# Altium project x-IMU3-CC-Serial-Adapter.PrjPcb
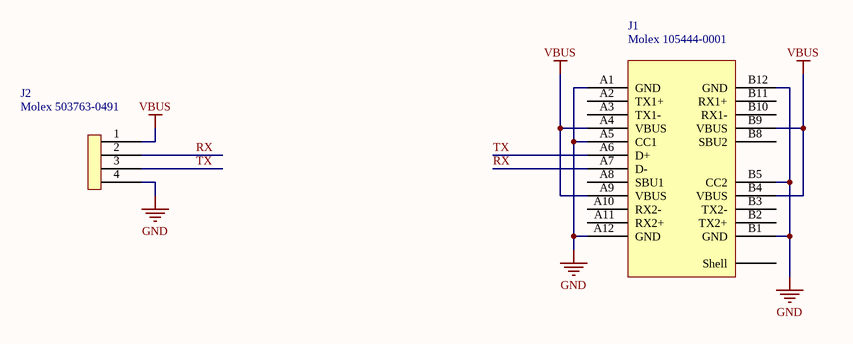
[diagram p0: Sheet1.SchDoc]
1 sheet, 2 parts. Net scope: global (net labels, ports and power ports of the same name join across sheets).

## Sheet Sheet1.SchDoc
size A4

### Parts
J1  Molex 105444-0001  [Molex 105444-0001]
J2  Molex 503763-0491  [Molex 503763-0491]

### Nets
GND: J1.A1(GND) J1.A5(CC1) J1.A12(GND) J1.B1(GND) J1.B5(CC2) J1.B12(GND) J2.4
VBUS: J1.A4(VBUS) J1.A9(VBUS) J1.B4(VBUS) J1.B9(VBUS) J2.1
RX: J1.A7(D-) J2.2
TX: J1.A6(D+) J2.3

Not connected (* = marked no-connect by the designer): J1 A2(TX1+) A3(TX1-) A8(SBU1) A10(RX2-) A11(RX2+) B2(TX2+) B3(TX2-) B8(SBU2) B10(RX1-) B11(RX1+) Shell

### Library data of the parts
J1 = USB-C Plug